# EAGLE schematic TLC5928_Breakout_Board (EAGLE 6.3)
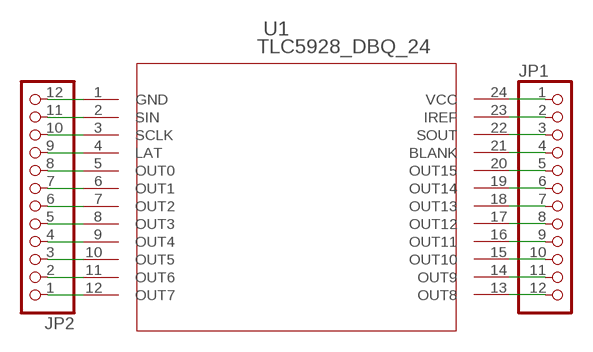
[diagram p0: schematic, sheet 1]

## Parts
JP1  PINHD-1X12  [1X12]
JP2  PINHD-1X12  [1X12]
U1  TLC5928_DBQ_24  [DBQ24]

## Nets
N$1: JP1.1 U1.24(VCC)
N$2: JP1.2 U1.23(IREF)
N$3: JP1.3 U1.22(SOUT)
N$4: JP1.4 U1.21(BLANK)
N$5: JP1.5 U1.20(OUT15)
N$6: JP1.6 U1.19(OUT14)
N$7: JP1.7 U1.18(OUT13)
N$8: JP1.8 U1.17(OUT12)
N$9: JP1.9 U1.16(OUT11)
N$10: JP1.10 U1.15(OUT10)
N$11: JP1.11 U1.14(OUT9)
N$12: JP1.12 U1.13(OUT8)
N$13: JP2.1 U1.12(OUT7)
N$14: JP2.2 U1.11(OUT6)
N$15: JP2.3 U1.10(OUT5)
N$16: JP2.4 U1.9(OUT4)
N$17: JP2.5 U1.8(OUT3)
N$18: JP2.6 U1.7(OUT2)
N$19: JP2.7 U1.6(OUT1)
N$20: JP2.8 U1.5(OUT0)
N$21: JP2.9 U1.4(LAT)
N$22: JP2.10 U1.3(SCLK)
N$23: JP2.11 U1.2(SIN)
N$24: JP2.12 U1.1(GND)

## Library data of the parts
JP1 JP2 = pinhead:PINHD-1X12: PIN HEADER
U1 = Imported:TLC5928_DBQ_24; DATASHEETURL: http://www.ti.com/lit/gpn/TLC5928; DESCRIPTION: 16 Channel Constant Current LED Driver with LED Open Detection; FAMILY_NAME: LED DRIVER; GENERIC_PART_NUMBER: TLC5928; INDUSTRY_STD_PKG_TYPE: SSOP/QSOP; MANUFACTURER: Texas Instruments; MANUFACTURER_PART_NUMBER: tlc5928_dbq_24; PACKAGE_DESIGNATOR: DBQ; PIN_COUNT: 24; VENDOR: Texas Instruments

## Net classes
0 default: width 0.305 mm, clearance 0.152 mm